# EAGLE design Naninator (EAGLE 6.2)
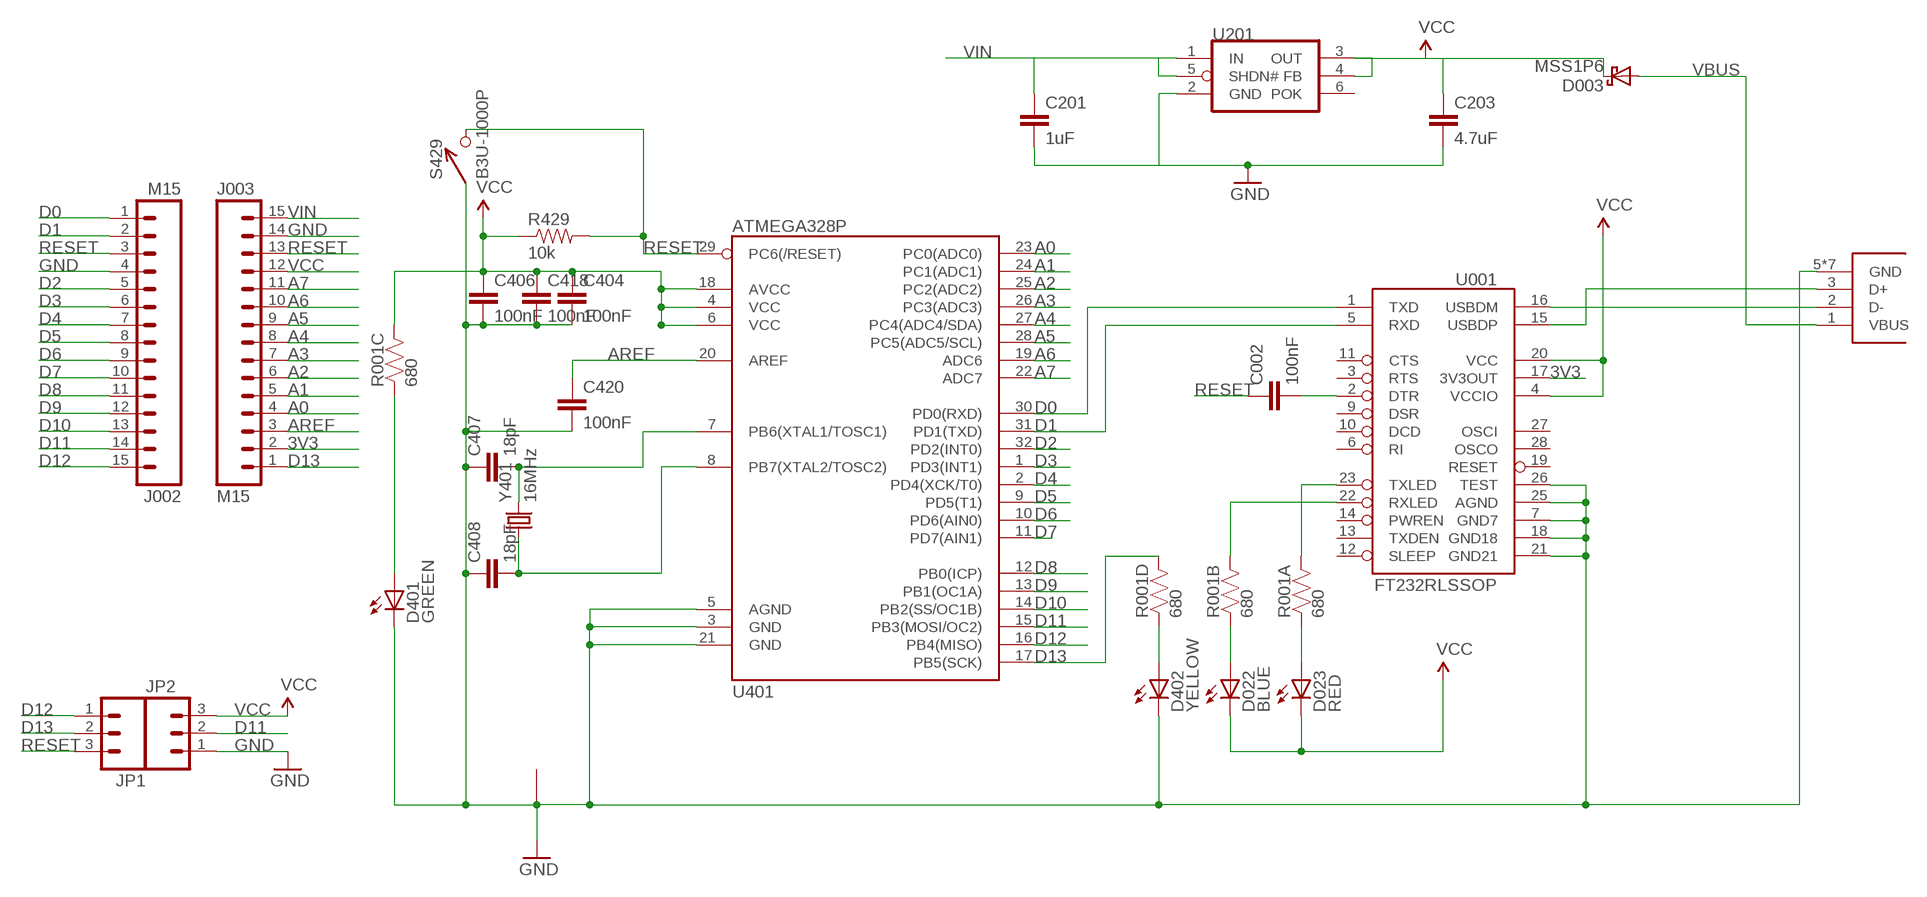
[diagram p0: schematic, sheet 1]

## Parts
C002  100nF  CAP0402-CAP  [0402-CAP]
C201  1uF  CAP0402-CAP  [0402-CAP]
C203  4.7uF  CAP0402-CAP  [0402-CAP]
C404  100nF  CAP0402-CAP  [0402-CAP]
C406  100nF  CAP0402-CAP  [0402-CAP]
C407  18pF  CAP0402-CAP  [0402-CAP]
C408  18pF  CAP0402-CAP  [0402-CAP]
C418  100nF  CAP0402-CAP  [0402-CAP]
C420  100nF  CAP0402-CAP  [0402-CAP]
D003  MSS1P6  [MICROSMP]
D022  BLUE  LED0603  [LED-0603]
D023  RED  LED0603  [LED-0603]
D401  GREEN  LED0603  [LED-0603]
D402  YELLOW  LED0603  [LED-0603]
J001  USB_MICROB_JST  [UB-MC5BR3-SD204-4S]
J002  M15  [1X15]
J003  M15  [1X15]
JP1  M03PTH  [1X03]
JP2  M03PTH  [1X03]
R001  680  RP404  [CRA04]
R429  10k  RESISTOR0402-RES  [0402-RES]
S429  B3U-1000P  [B3U-1000P]
U001  FT232RLSSOP  [SSOP28DB]
U201  MAX8881  [SOT-23-6]
U401  ATMEGA328P  ATMEGA168  [TQFP32-08]
Y401  16MHz  CX2520  [CRYSTAL_SMD_2MM_2_5MM]

## Nets
3V3: J003.2 U001.17(3V3OUT)
A0: J003.4 U401.23(PC0(ADC0))
A1: J003.5 U401.24(PC1(ADC1))
A2: J003.6 U401.25(PC2(ADC2))
A3: J003.7 U401.26(PC3(ADC3))
A4: J003.8 U401.27(PC4(ADC4/SDA))
A5: J003.9 U401.28(PC5(ADC5/SCL))
A6: J003.10 U401.19(ADC6)
A7: J003.11 U401.22(ADC7)
AREF: C420.1 J003.3 U401.20(AREF)
D0: J002.1 U001.1(TXD) U401.30(PD0(RXD))
D1: J002.2 U001.5(RXD) U401.31(PD1(TXD))
D2: J002.5 U401.32(PD2(INT0))
D3: J002.6 U401.1(PD3(INT1))
D4: J002.7 U401.2(PD4(XCK/T0))
D5: J002.8 U401.9(PD5(T1))
D6: J002.9 U401.10(PD6(AIN0))
D7: J002.10 U401.11(PD7(AIN1))
D8: J002.11 U401.12(PB0(ICP))
D9: J002.12 U401.13(PB1(OC1A))
D10: J002.13 U401.14(PB2(SS/OC1B))
D11: J002.14 JP2.2 U401.15(PB3(MOSI/OC2))
D12: J002.15 JP1.1 U401.16(PB4(MISO))
D13: J003.1 JP1.2 R001.5 U401.17(PB5(SCK))
DTR#: C002.2 U001.2(DTR)
GND: C201.2 C203.2 C404.2 C406.2 C407.1 C408.1 C418.2 C420.2 D401.C D402.C J001.5(GND) J001.P$6(GND) J001.P$7(GND) J001.P$8(GND) J001.P$9(GND) J001.P$10(GND) J001.P$11(GND) J002.4 J003.14 JP2.1 S429.P$1 U001.7(GND7) U001.18(GND18) U001.21(GND21) U001.25(AGND) U001.26(TEST) U201.2(GND) U401.3(GND) U401.5(AGND) U401.21(GND) Y401.2 Y401.4
N$1: C407.2 U401.7(PB6(XTAL1/TOSC1)) Y401.3
N$2: C408.2 U401.8(PB7(XTAL2/TOSC2)) Y401.1
N$3: J001.3(D+) U001.15(USBDP)
N$4: J001.2(D-) U001.16(USBDM)
N$5: D401.A R001.3
N$8: D402.A R001.4
N$9: D023.A R001.1
N$11: D022.A R001.2
RESET: C002.1 J002.3 J003.13 JP1.3 R429.2 S429.P$2 U401.29(PC6(/RESET))
RXLED1: R001.7 U001.22(RXLED)
TXLED1: R001.8 U001.23(TXLED)
VBUS: D003.A J001.1(VBUS)
VCC: C203.1 C404.1 C406.1 C418.1 D003.K D022.C D023.C J003.12 JP2.3 R001.6 R429.1 U001.4(VCCIO) U001.20(VCC) U201.3(OUT) U201.4(FB) U401.4(VCC) U401.6(VCC) U401.18(AVCC)
VIN: C201.1 J003.15 U201.1(IN) U201.5(SHDN#)
Unconnected: U001.3(RTS) U001.6(RI) U001.9(DSR) U001.10(DCD) U001.11(CTS) U001.12(SLEEP) U001.13(TXDEN) U001.14(PWREN) U001.19(RESET) U001.27(OSCI) U001.28(OSCO) U201.6(POK)

## Library data of the parts
C002 C404 C406 C418 C420 = SparkFun:CAP: Capacitor Standard 0603 ceramic capacitor, and 0.1" leaded capacitor.; DIGIKEY: 445-1268-1-ND
C201 = SparkFun:CAP: Capacitor Standard 0603 ceramic capacitor, and 0.1" leaded capacitor.; DIGIKEY: 445-1415-1-ND
C203 = SparkFun:CAP: Capacitor Standard 0603 ceramic capacitor, and 0.1" leaded capacitor.; DIGIKEY: 445-7395-1-ND
C407 C408 = SparkFun:CAP: Capacitor Standard 0603 ceramic capacitor, and 0.1" leaded capacitor.; DIGIKEY: 445-1238-1-ND
D003 = KwanSystems:MSS1P6; DIGIKEY: MSS1P6-M3/89AGICT-ND
D022 = SparkFun-LED:LED: LEDs Standard schematic elements and footprints for 5mm, 3mm, 1206, and 0603 sized LEDs. 5mm - Spark Fun Electronics SKU : COM-00529 (and others); DIGIKEY: 350-2037-1-ND
D023 = SparkFun-LED:LED: LEDs Standard schematic elements and footprints for 5mm, 3mm, 1206, and 0603 sized LEDs. 5mm - Spark Fun Electronics SKU : COM-00529 (and others); DIGIKEY: 754-1359-1-ND
D401 = SparkFun-LED:LED: LEDs Standard schematic elements and footprints for 5mm, 3mm, 1206, and 0603 sized LEDs. 5mm - Spark Fun Electronics SKU : COM-00529 (and others); DIGIKEY: 350-2036-1-ND
D402 = SparkFun-LED:LED: LEDs Standard schematic elements and footprints for 5mm, 3mm, 1206, and 0603 sized LEDs. 5mm - Spark Fun Electronics SKU : COM-00529 (and others); DIGIKEY: 754-1124-1-ND
J001 = KwanSystems:USB_MICROB_JST; DIGIKEY: 455-2562-1-ND
J002 J003 = SparkFun-Connectors:M15: Header 15 Standard 15-pin 0.1" header. Use with straight break away headers (SKU : PRT-00116), right angle break away headers (PRT-00553), swiss pins (PRT-00743), machine pins (PRT-00117), and female headers (PRT-00115).; DIGIKEY: $NOPART
JP1 JP2 = SparkFun-Connectors:M03: Header 3 Standard 3-pin 0.1" header. Use with straight break away headers (SKU : PRT-00116), right angle break away headers (PRT-00553), swiss pins (PRT-00743), machine pins (PRT-00117), and female headers (PRT-00115). Molex polarized connector foot print use with SKU : PRT-08232 with associated crimp pins and housings.; DIGIKEY: $NOPART
R001 = KwanSystems:RP4; DIGIKEY: CRA4S8680CT-ND
R429 = SparkFun-Passives:RESISTOR: Resistor Basic schematic elements and footprints for 0603, 1206, and PTH resistors.; DIGIKEY: P10.0KLCT-ND
S429 = KwanSystems:B3U-1000P
U001 = SparkFun-DigitalIC:FT232RL: USB UART FT232RL 4th Generation USB UART (USB <-> Serial) Controller. Spark Fun Electronics SKU : COM-00650; DIGIKEY: 768-1007-1-ND
U201 = KwanSystems:MAX8881; DIGIKEY: MAX8881EUT50+TCT-ND
U401 = SparkFun-DigitalIC:ATMEGA168: Atmel 32-pin 8-bit micro, 16k flash.; DIGIKEY: ATMEGA328P-15AZCT-ND
Y401 = KwanSystems:CX2520; DIGIKEY: 478-6955-1-ND

## Net classes
0 default: width 0.152 mm, drill 0.33 mm, clearance 0.152 mm

## Board
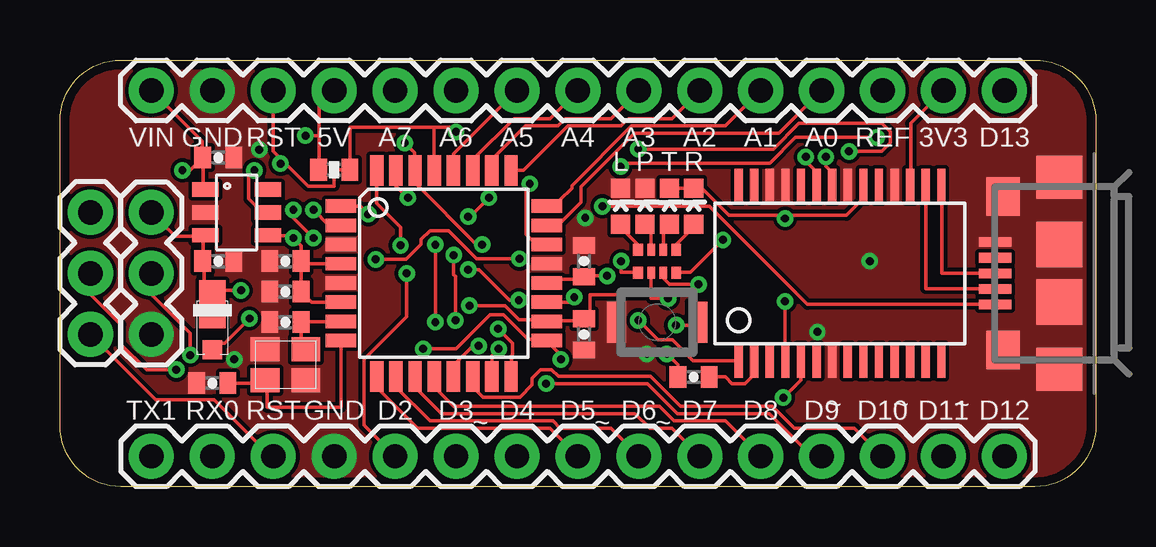
[diagram p1: board, top side]
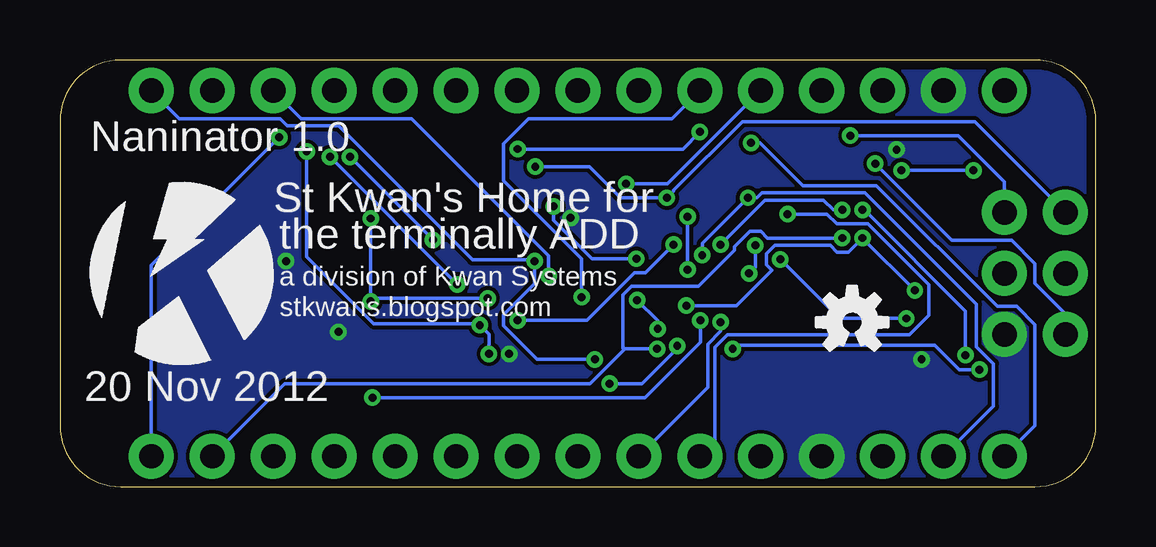
[diagram p2: board, bottom side, seen from below]

Size 43.18 x 17.78 mm. Coordinates in mm from the lower left corner, seen from the top.
Outline: 40.64,0 2.54,0 arc-90 0,2.54 0,15.24 arc-90 2.54,17.78 40.64,17.78 arc-90 43.18,15.24 43.18,2.54 arc-90 40.64,0
Copper layers (1*16): Top 0.0356mm / dielectric 1.5011mm / Bottom 0.0356mm
Design rules "default": minimum track width 6mil, minimum drill 13mil, track to track 6mil, track to pad 6mil, pad to pad 6mil, via to via 6mil, smd to smd 6mil, copper to edge 15mil, drill to drill 6mil, minimum pad ring 7mil, minimum via ring 7mil, stop-mask expansion 4mil, vias tented up to drill 14mil, thermal gap 10mil

### Footprints (pad centres in the part's own frame; a part is rotated, then mirrored left to right if it is on the bottom)
0402-CAP = smd 0.7 x 0.9: 1 -0.65,0; 2 0.65,0
MICROSMP = smd 0.8 x 0.8: A 0.9,0 | smd 2 x 1.1: K -1,0
LED-0603 = smd 0.8 x 0.8: A 0,-0.75; C 0,0.75
UB-MC5BR3-SD204-4S = smd 0.4 x 1.35: 1 -1.3,2.675; 2 -0.65,2.675; 3 0,2.675; 4 0.65,2.675; 5 1.3,2.675 | smd 1.8 x 1.9: P$6 4,0; P$7 -4,0 | smd 1.9 x 1.9: P$8 -1.2,0; P$9 1.2,0 | smd 1.6 x 1.4: P$10 -3.2,2.35; P$11 3.2,2.35
1X15 = drill 1.016 pad 1.88: 1 0,0; 2 2.54,0; 3 5.08,0; 4 7.62,0; 5 10.16,0; 6 12.7,0; 7 15.24,0; 8 17.78,0; 9 20.32,0; 10 22.86,0; 11 25.4,0; 12 27.94,0; 13 30.48,0; 14 33.02,0; 15 35.56,0
1X03 = drill 1.016 pad 1.88: 1 0,0; 2 2.54,0; 3 5.08,0
CRA04 = smd 0.4 x 0.5: 1 -0.8,-0.475; 4 0.8,-0.475; 5 0.8,0.475; 8 -0.8,0.475 | smd 0.3 x 0.5: 2 -0.25,-0.475; 3 0.25,-0.475; 6 0.25,0.475; 7 -0.25,0.475
0402-RES = smd 0.7 x 0.9: 1 -0.65,0; 2 0.65,0
B3U-1000P = smd 0.8 x 1.7: P$1 -1.7,0; P$2 1.7,0
SSOP28DB = smd 0.348 x 1.397: 1 -4.225,-3.656; 2 -3.575,-3.656; 3 -2.925,-3.656; 4 -2.275,-3.656; 5 -1.625,-3.656; 6 -0.975,-3.656; 7 -0.325,-3.656; 8 0.325,-3.656; 9 0.975,-3.656; 10 1.625,-3.656; 11 2.275,-3.656; 12 2.925,-3.656; 13 3.575,-3.656; 14 4.225,-3.656; 15 4.225,3.656; 16 3.575,3.656; 17 2.925,3.656; 18 2.275,3.656; 19 1.625,3.656; 20 0.975,3.656; 21 0.325,3.656; 22 -0.325,3.656; 23 -0.975,3.656; 24 -1.625,3.656; 25 -2.275,3.656; 26 -2.925,3.656; 27 -3.575,3.656; 28 -4.225,3.656
SOT-23-6 = smd 0.6 x 1.1: 1 -0.95,-1.3; 2 0,-1.3; 3 0.95,-1.3; 4 0.95,1.3; 5 0,1.3; 6 -0.95,1.3
TQFP32-08 = smd 1.27 x 0.559: 1 -4.293,2.8; 2 -4.293,2; 3 -4.293,1.2; 4 -4.293,0.4; 5 -4.293,-0.4; 6 -4.293,-1.2; 7 -4.293,-2; 8 -4.293,-2.8; 17 4.293,-2.8; 18 4.293,-2; 19 4.293,-1.2; 20 4.293,-0.4; 21 4.293,0.4; 22 4.293,1.2; 23 4.293,2; 24 4.293,2.8 | smd 0.559 x 1.27: 9 -2.8,-4.293; 10 -2,-4.293; 11 -1.2,-4.293; 12 -0.4,-4.293; 13 0.4,-4.293; 14 1.2,-4.293; 15 2,-4.293; 16 2.8,-4.293; 25 2.8,4.293; 26 2,4.293; 27 1.2,4.293; 28 0.4,4.293; 29 -0.4,4.293; 30 -1.2,4.293; 31 -2,4.293; 32 -2.8,4.293
CRYSTAL_SMD_2MM_2_5MM = smd 1.2 x 1: 1 -0.85,-0.65; 2 0.85,-0.65; 3 0.85,0.65; 4 -0.85,0.65

### Placement (x,y rotation side)
C002  26.42,4.57 0 top
C201  6.6,13.72 0 top
C203  6.6,9.4 0 top
C404  9.4,9.4 180 top
C406  9.4,8.13 180 top
C407  9.4,6.86 0 top
C408  6.35,4.32 0 top
C418  21.84,6.35 270 top
C420  21.84,9.4 90 top
D003  6.35,6.6 270 top
D022  25.4,11.68 0 top
D023  26.42,11.68 0 top
D401  24.38,11.68 0 top
D402  23.37,11.68 0 top
J001  41.66,8.89 90 top
J002  3.81,1.27 0 top
J003  39.37,16.51 180 top
JP1  1.27,11.43 270 top
JP2  3.81,6.35 90 top
R001  24.89,9.4 180 top
R429  11.43,13.21 0 top
S429  24.89,6.86 0 top
U001  32.51,8.89 0 top
U201  7.37,11.43 270 top
U401  16,8.89 0 top
U$1  [KWAN_CIRCLE]  38.1,8.89 0 bottom
U$2  [OSHW-LOGO-S]  10.16,6.86 0 bottom
Y401  9.4,5.08 0 top

### Tracks (layer width: path | path; a pad name or v marks a point on that pad's centre or on a via)
3V3
  Top 0.152: J003.2 35.46,15.14 35.46,12.55 U001.17
A0
  Top 0.152: J003.4 29.97,14.73 23.95,14.73 21.72,12.5 21.72,11.86 20.75,10.9 U401.23
A1
  Top 0.152: J003.5 27.74,15.04 23.82,15.04 21.34,12.55 21.34,12.45 20.83,11.94 20.83,11.71 20.3,11.71 U401.24
A2
  Top 0.152: U401.25 19.33,13.18 21.18,15.04 23.39,15.04 23.7,15.34 25.5,15.34 J003.6
A3
  Top 0.152: J003.7 22.96,15.34 21.06,15.34 20.75,15.04 19.41,15.04 18.01,13.64 U401.26
A4
  Top 0.152: J003.8 20.42,15.34 18.92,15.34 17.22,13.64 17.22,13.18 U401.27
A5
  Top 0.152: J003.9 16.41,13.87 U401.28
A6  (via drill 0.33)
  Top 0.152: v21.44,7.9 21.23,7.7 U401.19
  Bottom 0.152: v21.44,7.9 21.44,9.5 24.69,12.75 24.69,14.3 23.65,15.34 17.68,15.34 J003.10
A7  (via drill 0.33)
  Top 0.152: v19.58,12.62 19.43,12.47 19.43,10.52 19.84,10.11 20.3,10.11 U401.22
  Bottom 0.152: v19.58,12.62 17.86,12.62 J003.11
AREF  (via drill 0.33)
  Top 0.152: 21.84,8.74 C420.1 | v22.81,8.79 21.89,8.79 C420.1 | U401.20 20.3,8.64 21.84,8.64 C420.1
  Bottom 0.152: v22.81,8.79 22.81,9.63 28.52,15.34 33.12,15.34 J003.3
D0  (via drill 0.33)
  Top 0.152: v14.38,14.33 14.78,13.92 14.78,13.18 U401.30 14.83,13.13 14.83,12.62 17.37,10.08 v17.6,10.08 | v24.11,6.93 24.92,6.12 25.53,6.12 26.39,5.26 28.27,5.26 U001.1
  Bottom 0.152: v14.38,14.33 13.99,14.33 12.22,12.55 9.14,12.55 4.12,7.52 3.3,7.52 2.54,6.76 2.54,2.54 J002.1 | v24.11,6.93 21.21,6.93 19.23,8.91 18.77,8.91 v17.6,10.08
D1  (via drill 0.33)
  Top 0.152: v14.5,12.04 14.02,12.52 14.02,13.18 U401.31 | v30.15,3.71 30.89,4.45 U001.5 | v16.48,6.93 16.48,8.76 16.41,8.84 v16.41,9.65
  Bottom 0.152: J002.2 4.27,3.35 4.27,5.13 4.98,5.84 4.98,7.59 9.63,12.24 13.92,12.24 14.12,12.04 v14.5,12.04 16.41,10.13 v16.41,9.65 | v30.15,3.71 18.8,3.71 16.48,6.02 v16.48,6.93
D2  (via drill 0.33)
  Top 0.152: v14.2,10.06 14.2,10.82 13.21,11.81 U401.32 | v14.45,8.89 14.45,7.09 12.68,5.31 12.68,2.56 J002.5
  Bottom 0.152: v14.2,10.06 14.2,9.14 v14.45,8.89
D3  (via drill 0.33)
  Top 0.152: v12.85,11.35 12.52,11.68 U401.1
  Bottom 0.152: v12.85,11.35 11.2,11.35 10.79,10.95 9.5,10.95 6.96,8.41 6.96,7.14 7.77,6.33 15.37,6.33 15.88,5.82 15.88,1.91 J002.6
D4  (via drill 0.33)
  Top 0.152: v15.65,6.86 v15.65,10.08 | U401.2 11.2,10.9 v10.57,11.53
  Bottom 0.152: v10.57,11.53 10.95,11.53 11.35,11.94 13.79,11.94 v15.65,10.08 | v15.65,6.86 15.65,6.48 16.18,5.94 16.18,4.14 J002.7
D5
  Top 0.152: J002.8 20.42,2.44 14.91,2.44 13.21,4.14 U401.9
D6
  Top 0.152: J002.9 22.96,2.44 20.85,2.44 20.55,2.74 15.42,2.74 14.02,4.14 14.02,4.6 U401.10
D7
  Top 0.152: J002.10 25.5,2.44 24.59,2.44 23.98,3.05 15.9,3.05 14.81,4.14 U401.11
D8
  Top 0.152: J002.11 27.74,2.74 25.6,2.74 24.99,3.35 16.41,3.35 15.62,4.14 15.62,4.6 U401.12
D9  (via drill 0.33)
  Top 0.152: v17.45,5.87 17.22,5.87 16.41,5.05 U401.13 | v20.27,4.29 24.49,4.29 25.73,3.05 29.57,3.05 31.34,1.27 J002.12
  Bottom 0.152: v17.45,5.87 17.45,5.77 18.92,4.29 v20.27,4.29
D10
  Top 0.152: J002.13 33.12,2.44 30.61,2.44 29.69,3.35 25.86,3.35 24.61,4.6 20.78,4.6 20.5,4.88 20.04,4.88 19.68,4.52 19.68,4.24 19.18,3.73 17.63,3.73 17.22,4.14 17.22,4.6 U401.14
D11  (via drill 0.33)
  Top 0.152: v18.29,5.74 18.01,5.46 U401.15 | JP2.2 3.81,8.03 5.44,6.4 v5.44,5.49 | v9.73,11.53 9.73,11.2 v10.57,10.36
  Bottom 0.152: v18.29,5.74 19.63,5.74 19.66,5.71 | 19.66,5.71 21.08,4.29 33.81,4.29 J002.14 | v5.44,5.49 5.44,7.32 9.65,11.53 v9.73,11.53 | v10.57,10.36 13.69,10.36 13.97,10.64 14.43,10.64 15.06,10.01 15.06,9.86 16.56,8.36 19.36,8.36 19.71,8 19.71,5.77 19.66,5.71
D12  (via drill 0.33)
  Top 0.152: v18.26,6.58 18.87,5.97 18.87,5.51 18.82,5.46 18.82,4.6 U401.16 | v19.13,7.77 18.75,7.77 17.48,9.04 v17.02,9.04 | v17.02,11.25 17.09,11.25 v17.88,12.04 | v34.04,14.55 30.66,14.55 29.59,13.49 23.52,13.49 v23.37,13.34
  Bottom 0.152: v18.26,6.58 18.26,6.91 v19.13,7.77 | v17.02,11.25 v17.02,9.04 | JP1.1 5.05,15.21 14.73,15.21 17.6,12.34 17.6,12.32 v17.88,12.04 19.81,12.04 21.11,13.34 v23.37,13.34 | J002.15 39.37,9.22 v34.04,14.55
D13  (via drill 0.33)
  Top 0.152: v20.88,5.31 20.88,5.49 20.3,6.07 U401.17 20.24,6.15 19.51,6.15 18.49,7.16 17.93,7.16 16.51,5.74 v15.14,5.74 | R001.5 24.08,8.94 23.39,8.94 v23.39,9.4 | JP1.2 1.27,8.03 2.54,6.76 2.54,5.94 3.61,4.88 v4.85,4.88
  Bottom 0.152: v20.88,5.31 23.29,5.31 24.69,6.71 24.69,7.16 23.39,8.46 v23.39,9.4 23.44,9.45 25.98,9.45 31.57,15.04 33.71,15.04 34.01,15.34 38.2,15.34 J003.1 | v4.85,4.88 5.69,4.88 6.71,5.89 14.99,5.89 v15.14,5.74
DTR#
  Top 0.152: C002.2 27.74,4.57 28.02,4.29 28.55,4.29 28.93,4.67 U001.2
GND  (via drill 0.33)
  other vias: 24.46,5.54 31.57,6.45 33.76,9.4 8.31,14.05 21.89,11.2 7.26,5.31
  pour Bottom (no thermals): 2.54,17.78 40.64,17.78 arc-90 43.18,15.24 43.18,2.54 arc-90 40.64,0 2.54,0 arc-90 0,2.54 0,15.24 arc-90
  pour Top (no thermals): 2.54,17.78 40.64,17.78 arc-90 43.18,15.24 43.18,2.54 arc-90 40.64,0 2.54,0 arc-90 0,2.54 0,15.24 arc-90
N$1
  Top 0.152: Y401.3 10.24,5.74 10.06,5.92 C407.2 10.11,6.88 U401.7
N$2
  Top 0.152: C408.2 8.43,4.32 8.53,4.42 Y401.1 8.64,4.34 8.64,3.3 11.71,3.3 U401.8 11.71,5.66
N$3
  Top 0.152: U001.15 36.75,12.52 36.75,8.89 J001.3
N$4
  Top 0.152: J001.2 38.96,8.26 36.09,8.26 36.09,12.52 U001.16
N$5
  Top 0.152: R001.3 24.64,9.88 24.64,10.67 D401.A
N$8
  Top 0.152: D402.A 23.37,10.82 24.08,10.11 24.08,9.88 R001.4
N$9
  Top 0.152: D023.A 26.42,10.82 25.7,10.11 25.7,9.88 R001.1
N$11
  Top 0.152: R001.2 25.15,9.88 25.15,10.67 D022.A
RESET  (via drill 0.33)
  Top 0.152: J002.3 8.79,1.27 6.43,3.63 3.99,3.63 JP1.3 | v25.3,5.54 25.76,5.08 25.76,4.57 C002.1 | v25.68,6.73 26.44,6.73 26.57,6.86 | U401.29 15.6,14.99 | v32.89,13.97 34.27,13.97 34.62,14.33 34.62,14.78 34.27,15.14 30.81,15.14 29.74,14.07 v24.11,14.07 | J003.13 8.89,13.97 9.3,13.56 | 9.3,13.56 10.34,12.52 11.43,12.52 11.43,13.21 12.01,13.21 12.01,13.18 R429.2 12.09,14.99 15.6,14.99 | v9.2,13.46 9.3,13.56 | 15.6,14.99 16.31,14.99 v16.51,14.78
  Top 0.406: 26.57,6.86 S429.P$2
  Bottom 0.152: v25.3,5.54 25.3,6.35 v25.68,6.73 25.73,6.78 30.1,6.78 32.89,9.58 v32.89,13.97 | v24.11,14.07 17.22,14.07 v16.51,14.78 | JP1.3 1.27,7.21 2.54,8.48 2.54,9.3 3.5,10.26 5.99,10.26 v9.2,13.46
RXLED1  (via drill 0.33)
  Top 0.152: v26.62,8.43 25.4,8.43 25.15,8.69 R001.7 | v31.93,13.74 31.93,13.36 32.18,13.11 U001.22
  Bottom 0.152: v31.93,13.74 v26.62,8.43
TXLED1  (via drill 0.33)
  Top 0.152: v27.64,10.29 26.29,8.94 25.7,8.94 R001.8 | v31.09,13.74 31.09,13.56 31.52,13.13 31.52,12.55 U001.23
  Bottom 0.152: v31.09,13.74 v27.64,10.29
VBUS  (via drill 0.33)
  Top 0.152: v13.16,9.47 14.43,9.47 15.06,10.11 15.06,10.31 15.42,10.67 16.2,10.67 17.37,9.5 v19.15,9.5 | v22.61,11.68 27.08,11.68 31.17,7.59 38.96,7.59 J001.1 | 6.35,5.46 D003.A 6.35,5.84 6.6,5.84 6.73,5.97 6.86,5.97 v7.9,7.01
  Bottom 0.152: v7.9,7.01 10.69,7.01 v13.16,9.47 | v19.15,9.5 21.01,9.5 22.61,11.1 v22.61,11.68
VCC  (via drill 0.33)
  Top 0.152: 24.64,8.69 R001.6 24.64,8 | D022.C 25.4,12.45 26.42,12.45 D023.C 26.47,12.39 26.8,12.39 27.89,11.3 30.23,11.3 | 30.23,11.3 32.79,11.3 33.48,11.99 33.48,12.52 U001.20 | v30.23,7.72 30.23,5.26 U001.4 | 30.23,11.3 v30.23,11.18 | 10.79,14.63 10.79,15.88 J003.12 | 10.79,14.63 10.79,13.21 R429.1 | C404.1 C406.1 10.11,8.08 10.49,7.7 U401.6 | C404.1 9.98,9.42 9.93,9.42 9.91,9.4 | U201.4 8.69,10.46 9.63,10.46 v9.73,10.36 10.06,10.03 C404.1 | 11.71,9.27 U401.4 10.01,9.29 9.91,9.4 | JP2.3 4.8,10.44 5.92,10.44 U201.3 6.04,10.46 5.97,10.39 5.97,9.14 C203.1 6.02,9.09 6.02,7.7 6.35,7.37 D003.K 6.07,8.18 v7.54,8.18 | v10.24,14.63 10.79,14.63 | v17.07,7.54 18.54,7.54 19.13,6.96 20.24,6.96 U401.18 20.3,6.91 21.74,6.91 21.79,6.96 C418.1 21.99,7 22.1,7.11 22.1,8 24.64,8 | 9.91,9.4 10.16,9.4 | v25.35,7.85 24.64,7.85 24.64,8
  Bottom 0.152: v30.23,11.18 v30.23,7.72 30.18,7.85 v25.35,7.85 | v7.54,8.18 v9.73,10.36 10.31,9.78 10.79,9.78 11.07,10.06 13.39,10.06 13.74,9.7 13.74,9.25 13.51,9.02 14.99,7.54 v17.07,7.54 | v10.24,14.63 5.74,14.63 3.81,12.7 JP2.3
VIN  (via drill 0.33)
  Top 0.152: 5.97,13.72 5.97,12.47 6.04,12.39 U201.1 | 5.97,13.72 C201.1 5.92,13.77 5.92,14.4 J003.15 | U201.5 8.43,11.43 7.87,11.99 7.87,12.95 v8.1,13.18 | 5.33,13.21 5.31,13.18 v5.11,13.18 5.44,13.18 5.97,13.72
  Bottom 0.152: v5.11,13.18 v8.1,13.18

### Text on the board
tPlace: VIN | GND | RST | 5V | A7 | A6 | A5 | A4 | A3 | A2 | A1 | A0 | REF | 3V3 | D13 | L | P | T | R | TX1 | RX0 | RST | GND | D2 | D3 | D4 | D5 | D6 | D7 | D8 | D9 | ~ | D10 | ~ | D11 | ~ | D12 | ~ | ~ | ~
bPlace: Naninator 1.0 | St Kwan's Home for | the terminally ADD | a division of Kwan Systems | stkwans.blogspot.com | 20 Nov 2012